# Altium schematic sheet ls.SchDoc
size A4
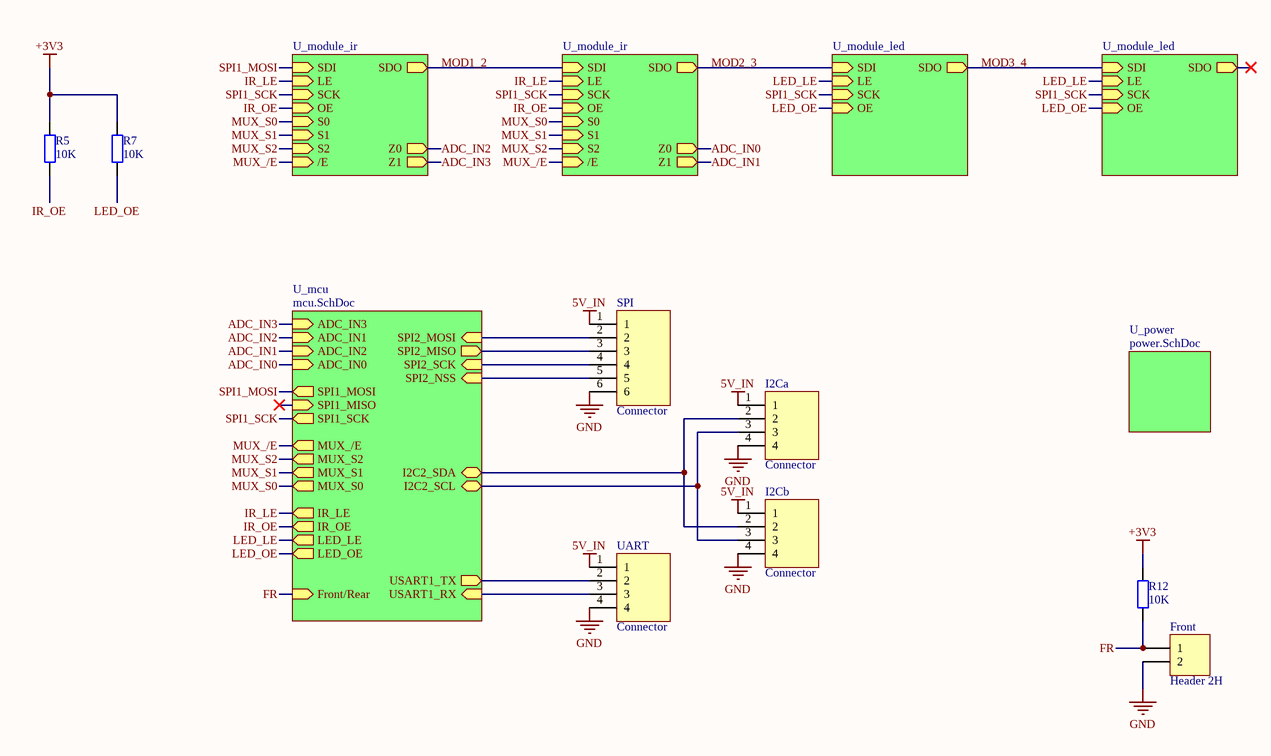
[diagram p0: ls.SchDoc]

## Parts
Front  Header 2H  [HDR1X2H]
I2Ca  Connector  [FP_CONN4_TAP_254MM_90]
I2Cb  Connector  [FP_CONN4_TAP_254MM_90]
R5  10K  [FP_0805_RES]
R7  10K  [FP_0805_RES]
R12  10K  [FP_0805_RES]
SPI  Connector  [FP_CONN6_TAP_254MM_90]
UART  Connector  [FP_CONN4_TAP_254MM_90]

## Sub-sheets
U_mcu = mcu.SchDoc: SPI1_MISO (in), SPI1_SCK (out), SPI1_MOSI (out), ADC_IN3 (in), ADC_IN1 (in), ADC_IN2 (in), ADC_IN0 (in), MUX_/E (out), MUX_S2 (out), MUX_S1 (out), MUX_S0 (out), LED_LE (out), IR_OE (out), LED_OE (out), IR_LE (out), SPI2_SCK (in), SPI2_MISO (out), SPI2_MOSI (in), SPI2_NSS (in), I2C2_SDA (bidir), I2C2_SCL (bidir), USART1_RX (in), USART1_TX (out), Front/Rear (in)
U_module_ir = module_ir.SchDoc: SDI (in), SDO (out), LE (in), SCK (in), OE (in), Z0 (out), Z1 (out), S0 (in), S1 (in), S2 (in), /E (in)
U_module_ir = module_ir.SchDoc: SDI (in), SDO (out), LE (in), SCK (in), OE (in), Z0 (out), Z1 (out), S0 (in), S1 (in), S2 (in), /E (in)
U_module_led = module_led.SchDoc: SDI (in), SDO (out), LE (in), SCK (in), OE (in)
U_module_led = module_led.SchDoc: SDI (in), SDO (out), LE (in), SCK (in), OE (in)
U_power = power.SchDoc: no entries

## Nets
5V_IN: I2Ca.1 I2Cb.1 SPI.1 UART.1
+3V3: R5.2 R7.2 R12.2
GND: Front.2 I2Ca.4 I2Cb.4 SPI.6 UART.4
ADC_IN0: sheet U_mcu/ADC_IN0, sheet U_module_ir/Z0
ADC_IN1: sheet U_mcu/ADC_IN2, sheet U_module_ir/Z1
ADC_IN2: sheet U_mcu/ADC_IN1, sheet U_module_ir/Z0
ADC_IN3: sheet U_mcu/ADC_IN3, sheet U_module_ir/Z1
FR: Front.1 R12.1 ; sheet U_mcu/Front/Rear
IR_LE: sheet U_mcu/IR_LE, sheet U_module_ir/LE, sheet U_module_ir/LE
IR_OE: R5.1 ; sheet U_mcu/IR_OE, sheet U_module_ir/OE, sheet U_module_ir/OE
LED_LE: sheet U_mcu/LED_LE, sheet U_module_led/LE, sheet U_module_led/LE
LED_OE: R7.1 ; sheet U_mcu/LED_OE, sheet U_module_led/OE, sheet U_module_led/OE
MUX_/E: sheet U_mcu/MUX_/E, sheet U_module_ir//E, sheet U_module_ir//E
MUX_S0: sheet U_mcu/MUX_S0, sheet U_module_ir/S0, sheet U_module_ir/S0
MUX_S1: sheet U_mcu/MUX_S1, sheet U_module_ir/S1, sheet U_module_ir/S1
MUX_S2: sheet U_mcu/MUX_S2, sheet U_module_ir/S2, sheet U_module_ir/S2
SPI1_MOSI: sheet U_mcu/SPI1_MOSI, sheet U_module_ir/SDI
SPI1_SCK: sheet U_mcu/SPI1_SCK, sheet U_module_ir/SCK, sheet U_module_ir/SCK, sheet U_module_led/SCK, sheet U_module_led/SCK
NetI2Ca_2: I2Ca.2 I2Cb.2 ; sheet U_mcu/I2C2_SDA
NetI2Ca_3: I2Ca.3 I2Cb.3 ; sheet U_mcu/I2C2_SCL
NetSPI_2: SPI.2 ; sheet U_mcu/SPI2_MOSI
NetSPI_3: SPI.3 ; sheet U_mcu/SPI2_MISO
NetSPI_4: SPI.4 ; sheet U_mcu/SPI2_SCK
NetSPI_5: SPI.5 ; sheet U_mcu/SPI2_NSS
NetUART_2: UART.2 ; sheet U_mcu/USART1_TX
NetUART_3: UART.3 ; sheet U_mcu/USART1_RX
(unnamed): sheet U_module_ir/SDO, sheet U_module_ir/SDI
(unnamed): sheet U_module_ir/SDO, sheet U_module_led/SDI
(unnamed): sheet U_module_led/SDO, sheet U_module_led/SDI

## Notes on the sheet
- Labels drawn without touching a wire or pin: MOD1_2, MOD2_3, MOD3_4

## Library data of the parts
Front = Header 2H: Header, 2-Pin, Right Angle; Reference: ???; LatestRevisionDate: 17-Jul-2002; LatestRevisionNote: Re-released for DXP Platform.; Publisher: Altium Limited; Supplier: Árwill
I2Ca I2Cb UART = Connector_4pin: 4pin Connector; Reference: 1675775; Name: 4 pin header; Supplier: Farnell
R5 R7 R12 = RES: Resistor; Reference: 2861913; Supplier: Farnell; Value: 10K
SPI = Connector_6pin: 6pin connector; Reference: 1002.4071; Supplier: Hestore; Name: 6 pin connector